# EAGLE design board (EAGLE 6.2)
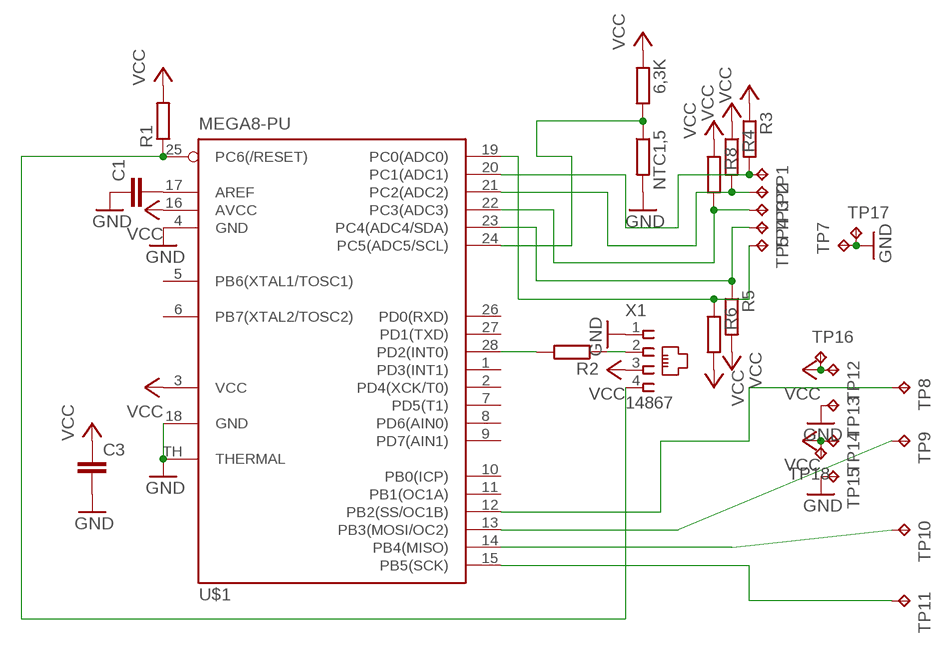
[diagram p0: schematic, sheet 1]

## Parts
6,3K  R-EU_R0805  [R0805]
C1  C-EUC0805  [C0805]
C3  C-EUC0805  [C0805]
NTC1,5  R-EU_0207/7  [0207/7]
R1  R-EU_R0805  [R0805]
R2  R-EU_R0805  [R0805]
R3  R-EU_R0805  [R0805]
R4  R-EU_R0805  [R0805]
R5  R-EU_R0805  [R0805]
R6  R-EU_R0805  [R0805]
R8  R-EU_R0805  [R0805]
TP1  TPPAD1-13  [P1-13]
TP2  TPPAD1-13  [P1-13]
TP3  TPPAD1-13  [P1-13]
TP4  TPPAD1-13  [P1-13]
TP5  TPPAD1-13  [P1-13]
TP7  TPPAD1-13  [P1-13]
TP8  TPPAD1-13  [P1-13]
TP9  TPPAD1-13  [P1-13]
TP10  TPPAD1-13  [P1-13]
TP11  TPPAD1-13  [P1-13]
TP12  TPPAD1-13  [P1-13]
TP13  TPPAD1-13  [P1-13]
TP14  TPPAD1-13  [P1-13]
TP15  TPPAD1-13  [P1-13]
TP16  TPPAD1-13  [P1-13]
TP17  TPPAD1-13  [P1-13]
TP18  TPPAD1-13  [P1-13]
U$1  MEGA8-PU  [MLF28-TH]
X1  14867  [14867]

## Nets
GND: C1.1 C3.2 NTC1,5.2 TP7.TP TP13.TP TP15.TP TP17.TP U$1.4(GND) U$1.18(GND) U$1.TH(THERMAL) X1.1
N$1: R2.2 U$1.28(PD2(INT0))
N$3: R1.1 U$1.25(PC6(/RESET)) X1.4
N$4: TP8.TP U$1.12(PB2(SS/OC1B))
N$5: TP10.TP U$1.14(PB4(MISO))
N$6: C1.2 U$1.17(AREF)
N$7: TP9.TP U$1.13(PB3(MOSI/OC2))
N$12: R8.2 TP3.TP U$1.22(PC3(ADC3))
N$14: R3.2 TP1.TP U$1.20(PC1(ADC1))
N$15: R5.1 TP4.TP U$1.23(PC4(ADC4/SDA))
N$17: R6.1 TP5.TP U$1.19(PC0(ADC0))
N$18: 6,3K.2 NTC1,5.1 U$1.24(PC5(ADC5/SCL))
N$21: R2.1 X1.2
N$22: TP11.TP U$1.15(PB5(SCK))
N$51: R4.2 TP2.TP U$1.21(PC2(ADC2))
VCC: 6,3K.1 C3.1 R1.2 R3.1 R4.1 R5.2 R6.2 R8.1 TP12.TP TP14.TP TP16.TP TP18.TP U$1.3(VCC) U$1.16(AVCC) X1.3
Unconnected: U$1.1(PD3(INT1)) U$1.2(PD4(XCK/T0)) U$1.5(PB6(XTAL1/TOSC1)) U$1.6(PB7(XTAL2/TOSC2)) U$1.7(PD5(T1)) U$1.8(PD6(AIN0)) U$1.9(PD7(AIN1)) U$1.10(PB0(ICP)) U$1.11(PB1(OC1A)) U$1.26(PD0(RXD)) U$1.27(PD1(TXD))

## Library data of the parts
6,3K NTC1,5 R1-R6 R8 = rcl:R-EU_: RESISTOR, European symbol
C1 C3 = rcl:C-EU: CAPACITOR, European symbol
TP1-TP5 TP7-TP18 = testpad:TP: Test pad
U$1 = atmel:MEGA8-PU
X1 = con-4ucon:14867: RJ11 Connector Source: 4UCON TECHNOLOGY INC. 14867.pdf; OC_FARNELL: unknown; OC_NEWARK: unknown

## Net classes
0 default: width 0.12 mm

## Board
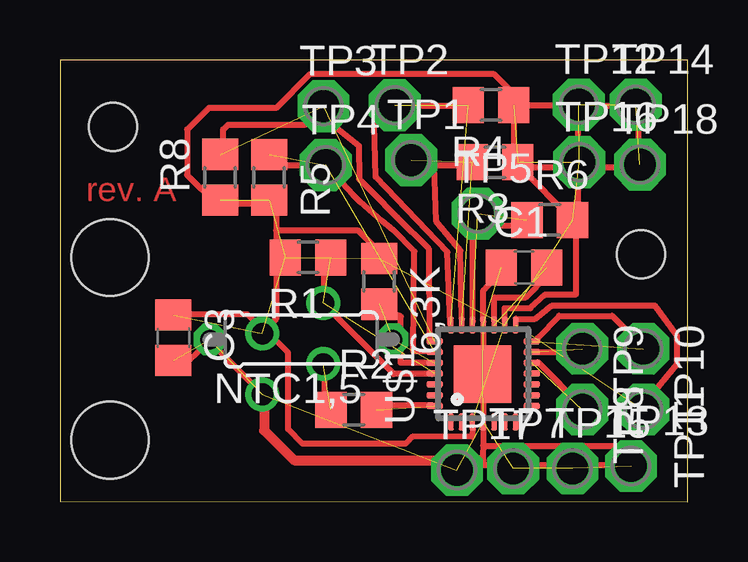
[diagram p1: board, top side]
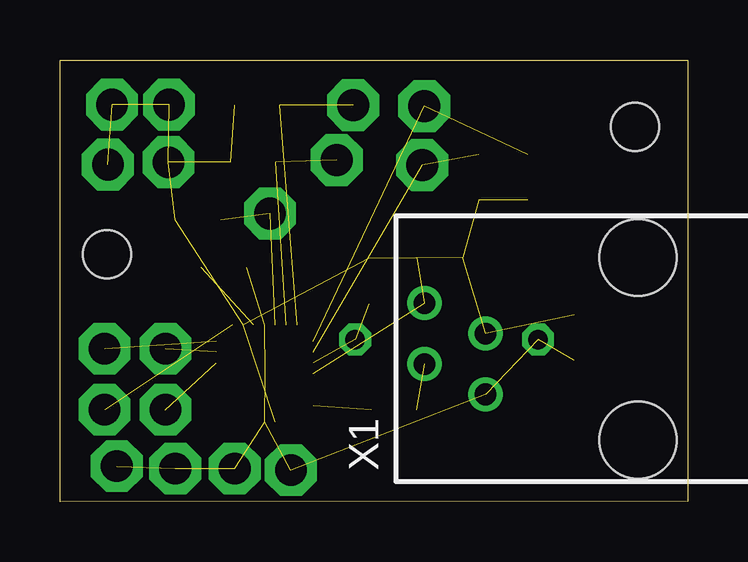
[diagram p2: board, bottom side, seen from below]

Size 26.16 x 18.42 mm. Coordinates in mm from the lower left corner, seen from the top.
Outline: 0,0.02 26.16,0 26.16,18.42 0,18.42 0,0.02
Copper layers (1*16): Top 0.035mm / dielectric 1.5mm / Bottom 0.035mm
Design rules: minimum track width 5mil, minimum drill 24mil, track to track 8mil, track to pad 8mil, pad to pad 8mil, via to via 8mil, smd to smd 8mil, copper to edge 40mil, drill to drill 8mil, minimum pad ring 10mil, minimum via ring 8mil, stop-mask expansion 4mil, vias tented up to drill 0mil, thermal gap 10mil
Holes 2 mm at 2.2,15.62 24.2,10.32

### Footprints (pad centres in the part's own frame; a part is rotated, then mirrored left to right if it is on the bottom)
R0805 = smd 1.3 x 1.5: 1 -0.95,0; 2 0.95,0
C0805 = smd 1.3 x 1.5: 1 -0.95,0; 2 0.95,0
0207/7 = drill 0.813 octagon: 1 -3.81,0; 2 3.81,0
P1-13 = drill 1.321 pad 2.159 octagon: TP 0,0
MLF28-TH = smd 0.7 x 0.25: 1 -2.42,1.67; 2 -2.42,1.22; 3 -2.42,0.77; 4 -2.42,0.32; 5 -2.42,-0.13; 6 -2.42,-0.58; 7 -2.42,-1.03; 15 1.62,-1.03; 16 1.62,-0.58; 17 1.62,-0.13; 18 1.62,0.32; 19 1.62,0.77; 20 1.62,1.22; 21 1.62,1.67 | smd 0.25 x 0.7: 8 -1.75,-1.7; 9 -1.3,-1.7; 10 -0.85,-1.7; 11 -0.4,-1.7; 12 0.05,-1.7; 13 0.5,-1.7; 14 0.95,-1.7; 22 0.95,2.34; 23 0.5,2.34; 24 0.05,2.34; 25 -0.4,2.34; 26 -0.85,2.34; 27 -1.3,2.34; 28 -1.75,2.34 | smd 2.4 x 2.4: TH -0.42,0.35
14867 = drill 0.9 pad 1.422: 1 -1.905,6.35; 2 -0.635,8.89; 3 0.635,6.35; 4 1.905,8.89 | hole 3.2: -3.81,0; 3.81,0

### Placement (x,y rotation side)
6,3K  13.3,9.18 270 top
C1  19.33,9.76 0 top
C3  4.72,6.84 270 top
NTC1,5  10.05,6.76 180 top
R1  10.34,10.18 180 top
R2  12.24,3.83 0 top
R3  18.12,14.15 180 top
R4  17.95,16.54 180 top
R5  8.71,13.53 270 top
R6  20.41,11.74 0 top
R8  6.67,13.53 90 top
TP1  14.63,14.24 0 top
TP2  13.95,16.54 0 top
TP3  10.98,16.5 0 top
TP4  11.07,14.04 0 top
TP5  17.41,12.01 0 top
TP7  18.88,1.38 0 top
TP8  21.77,3.83 270 top
TP9  21.77,6.38 270 top
TP10  24.3,6.38 270 top
TP11  24.3,3.83 270 top
TP12  21.61,16.55 0 top
TP13  23.8,1.48 0 top
TP14  23.99,16.55 0 top
TP15  21.36,1.38 0 top
TP16  21.64,14.15 0 top
TP17  16.54,1.31 0 top
TP18  24.16,14.05 0 top
U$1  17.95,5.74 90 top
X1  2.08,6.38 90 bottom

### Tracks (layer width: path | path; a pad name or v marks a point on that pad's centre or on a via)
GND  (10 unrouted)
N$1  (1 unrouted)
N$2
  Top 0.254: 15.4,6.24 14.72,6.26 14.77,10.44 13.9,11.31 13.43,11.7 12.51,12.51 12.46,12.54 12.2,12.8 11.1,14.02
N$3  (2 unrouted)
N$4  (1 unrouted)
N$5  (1 unrouted)
N$6  (1 unrouted)
N$7  (1 unrouted)
N$8
  Top 0.254: 15.5,4.02 13.4,4.02
N$9
  Top 0.254: 11.1,16.42 11.1,15.92 12.45,14.84 12.46,13.46 12.96,12.96 14.06,11.85 15.36,10.55 15.39,6.68
N$10
  Top 0.254: 11,14.02 8.4,14.02
N$11
  Top 0.254: 14,16.52 17.1,16.52
N$12  (2 unrouted)
N$13
  Top 0.254: 19.6,6.25 20.9,6.25
N$14  (2 unrouted)
N$15  (2 unrouted)
N$16
  Top 0.254: 17.4,11.52 19.9,11.52
N$17  (2 unrouted)
N$18  (2 unrouted)
N$19
  Top 0.254: 11,5.62 11,4.02
N$20
  Top 0.254: 6.7,6.52 6.6,6.52 | 6.6,6.52 6,6.52 5.1,5.62 | 6.6,6.52 6.6,6.32 8.5,4.42
N$21  (1 unrouted)
N$22  (1 unrouted)
N$23
  Top 0.254: 13.3,8.02 14.2,7.72 14.19,5.79 15.49,5.79
N$24
  Top 0.254: 15.5,5.32 13.9,5.32 11,8.22 11,9.92 10.9,10.02
N$25
  Top 0.254: 6.6,12.42 8.7,12.42 8.8,12.32 9,12.32 9,11.32 | 9,11.32 9,7.62 8.4,7.02 | 9,11.32 12.4,11.32 13.3,10.42
N$26
  Top 0.254: 6.8,14.32 6.8,15.52 7,15.72 10.2,15.72 11,16.52
N$27
  Top 0.254: 17.2,7.52 17.2,11.62
N$28
  Top 0.254: 16.74,7.61 16.68,10.47 15.68,11.69 15.6,14.02 | 17.7,14.02 15.6,14.02 | 15.6,14.02 14.7,14.02 14.6,14.12
N$29
  Top 0.254: 16.25,7.42 16.14,10.4 13.15,13.54 13.1,15.72 13.9,16.52
N$30
  Top 0.254: 18.9,16.52 18.9,14.22 21.6,11.52
N$31
  Top 0.254: 17.64,7.51 17.64,8.81 18.2,9.42
N$32
  Top 0.254: 18.1,7.52 18.1,8.52 19.4,8.52 20.3,9.42
N$33
  Top 0.254: 18.53,7.52 18.53,8.07 19.6,8.07 20.21,8.63 21.5,8.64 21.5,11.22
N$34
  Top 0.254: 18.99,7.62 19.8,7.62 20.49,8.18 24.79,8.18 25.7,6.92 25.7,5.72 24.2,3.92 24.3,3.92 24.4,4.02
N$35
  Top 0.254: 19.9,6.72 19.9,6.82 20.8,7.75 23,7.75 24.3,6.42
N$36
  Top 0.254: 21.8,3.82 21.8,3.92 19.9,5.82
N$37
  Top 0.254: 17.63,7.23 17.64,3.41
N$38
  Top 0.254: 23.7,1.52 16.5,1.52
N$39
  Top 0.254: 4.8,7.82 7.8,7.82 8.6,7.02
N$40
  Top 0.254: 17.63,2.33 23.5,2.32 | 17.63,3.23 17.63,2.33 | 17.63,2.33 17.6,1.62
N$41
  Top 0.254: 17.19,3.11 17.18,2.71 14.7,2.72 14.4,2.42 10.1,2.42 9.5,3.02 9.5,6.22 8.6,7.12
N$42
  Top 0.254: 21.6,12.12 21.6,16.52 | 21.6,16.52 24,16.52 24.1,16.42 24.1,13.92 19.5,13.92 19.3,14.12 | 21.6,16.52 19.2,16.52
N$43
  Top 0.254: 18.9,16.82 18.9,17.02 18.1,17.82 10.4,17.82 9,16.42 6.2,16.42 5.3,15.52 5.3,13.62 6.5,12.42
N$44
  Top 0.406: 8.51,4.39 8.51,2.97 9.75,1.73 17.53,1.73 17.57,1.69
N$51  (2 unrouted)
VCC  (14 unrouted)

### Text on the board
Top: rev. A